# Altium project Nestling_2.0.PrjPCB
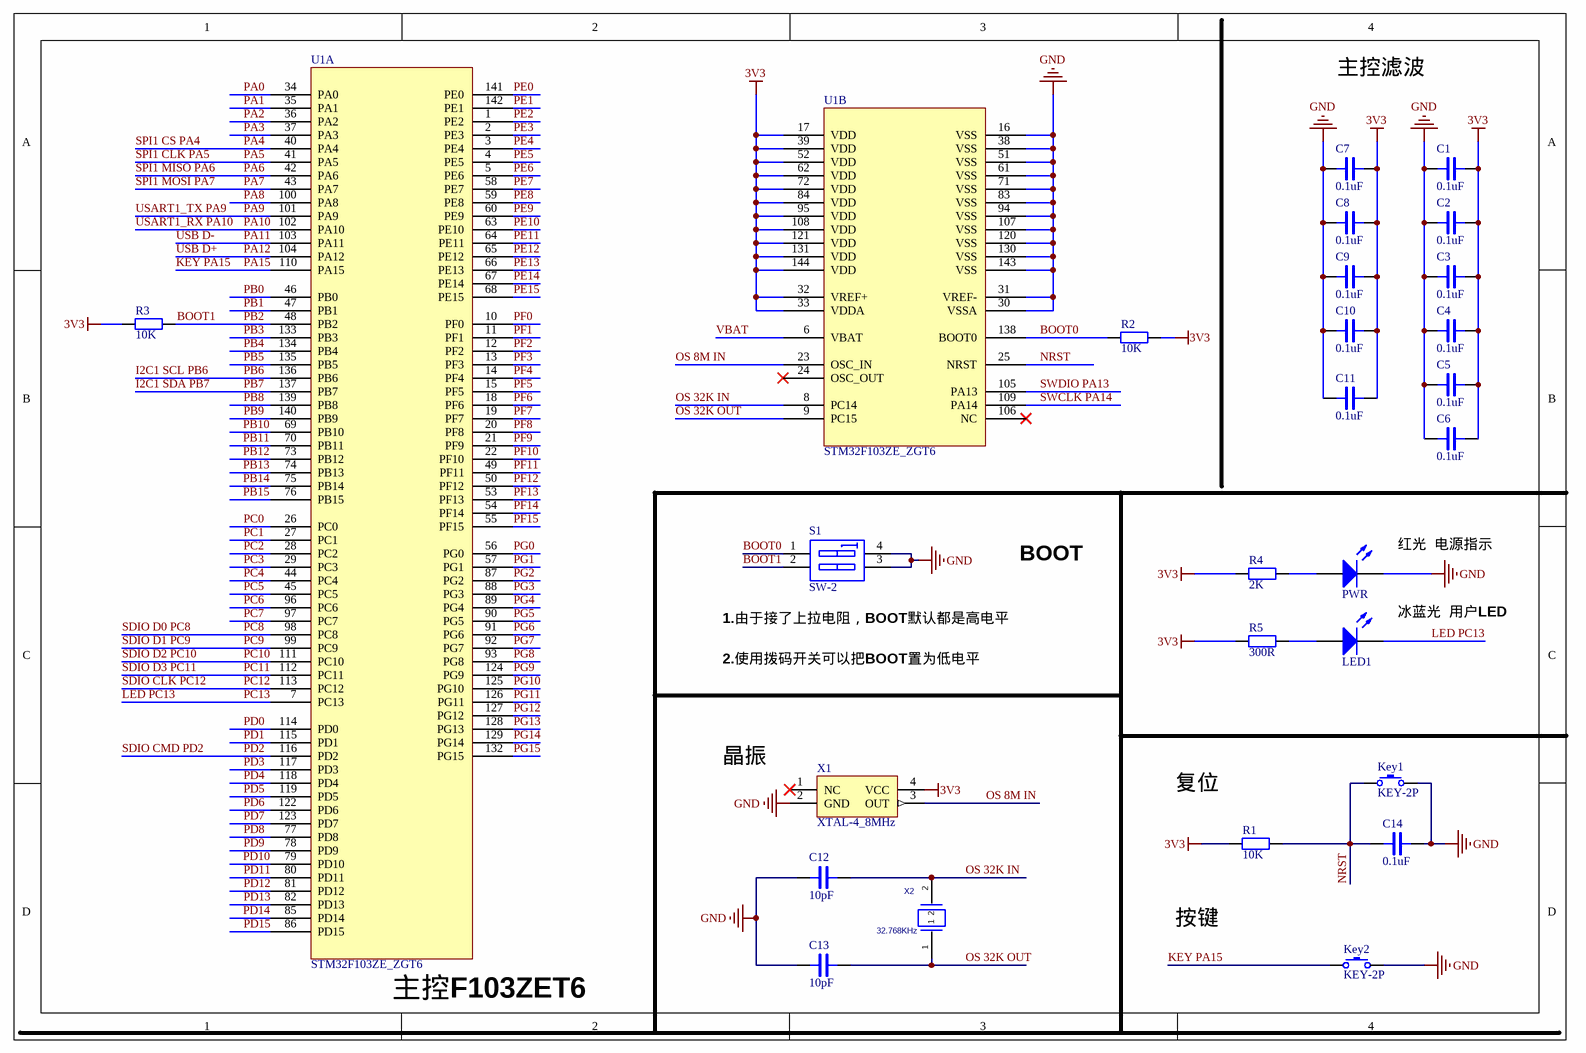
[diagram p0: 主控系统板.SchDoc]
2 sheets, 54 parts. Net scope: global (net labels, ports and power ports of the same name join across sheets).
Board file: Nestling_2.0.PcbDoc
Sheets:
  主控系统板.SchDoc
  主控系统板2.SchDoc

## Sheet 主控系统板.SchDoc
size A4

### Parts
C1  0.1uF  [0603]
C2  0.1uF  [0603]
C3  0.1uF  [0603]
C4  0.1uF  [0603]
C5  0.1uF  [0603]
C6  0.1uF  [0603]
C7  0.1uF  [0603]
C8  0.1uF  [0603]
C9  0.1uF  [0603]
C10  0.1uF  [0603]
C11  0.1uF  [0603]
C12  10pF  [0603]
C13  10pF  [0603]
C14  0.1uF  [0603]
Key1  KEY-2P  [TSW SMD-3*6*2.5]
Key2  KEY-2P  [TSW SMD-3*6*2.5]
LED1  LED  [D0603]  (value not drawn)
PWR  LED  [D0603]  (value not drawn)
R1  10K  [0603]
R2  10K  [0603]
R3  10K  [0603]
R4  2K  [0603]
R5  300R  [0603]
S1  SW-2  [CSW1.27 SMD-2P]
U1  STM32F103ZE_ZGT6  [TQFP144_N]  (parts A,B of 2)
X1  XTAL-4_8MHz  [XTAL-5.0X3.2]
X2  value 32.768KHz  [3215]  (hidden comment: XTAL_32.768KHZ_3215)

### Nets
3V3: C1.2 C2.2 C3.2 C4.2 C5.2 C6.2 C7.2 C8.2 C9.2 C10.2 C11.2 R1.1 R2.2 R3.2 R4.2 R5.2 U1.17(VDD) U1.32(VREF+) U1.33(VDDA) U1.39(VDD) U1.52(VDD) U1.62(VDD) U1.72(VDD) U1.84(VDD) U1.95(VDD) U1.108(VDD) U1.121(VDD) U1.131(VDD) U1.144(VDD) X1.4(VCC)
GND: C1.1 C2.1 C3.1 C4.1 C5.1 C6.1 C7.1 C8.1 C9.1 C10.1 C11.1 C12.2 C13.2 C14.1 Key1.2 Key2.2 PWR.2(K) S1.3(B2) S1.4(B1) U1.16(VSS) U1.30(VSSA) U1.31(VREF-) U1.38(VSS) U1.51(VSS) U1.61(VSS) U1.71(VSS) U1.83(VSS) U1.94(VSS) U1.107(VSS) U1.120(VSS) U1.130(VSS) U1.143(VSS) X1.2(GND)
BOOT0: R2.1 S1.1(A1) U1.138(BOOT0)
BOOT1: R3.1 S1.2(A2) U1.48(PB2)  [also labelled PB2]
I2C1 SCL PB6: U1.136(PB6)  [also labelled PB6]
I2C1 SDA PB7: U1.137(PB7)  [also labelled PB7]
KEY PA15: Key2.1 U1.110(PA15)  [also labelled PA15]
LED PC13: LED1.2(K) U1.7(PC13)  [also labelled PC13]
NRST: C14.2 Key1.1 R1.2 U1.25(NRST)
OS 8M IN: U1.23(OSC_IN) X1.3(OUT)
OS 32K IN: C12.1 U1.8(PC14) X2.2
OS 32K OUT: C13.1 U1.9(PC15) X2.1
PA0: U1.34(PA0)
PA1: U1.35(PA1)
PA2: U1.36(PA2)
PA3: U1.37(PA3)
PA4: U1.40(PA4)  [also labelled SPI1 CS PA4]
PA5: U1.41(PA5)  [also labelled SPI1 CLK PA5]
PA6: U1.42(PA6)  [also labelled SPI1 MISO PA6]
PA7: U1.43(PA7)  [also labelled SPI1 MOSI PA7]
PA8: U1.100(PA8)
PA9: U1.101(PA9)  [also labelled USART1_TX PA9]
PA10: U1.102(PA10)  [also labelled USART1_RX PA10]
PA11: U1.103(PA11)  [also labelled USB D-]
PA12: U1.104(PA12)  [also labelled USB D+]
PB0: U1.46(PB0)
PB1: U1.47(PB1)
PB3: U1.133(PB3)
PB4: U1.134(PB4)
PB5: U1.135(PB5)
PB8: U1.139(PB8)
PB9: U1.140(PB9)
PB10: U1.69(PB10)
PB11: U1.70(PB11)
PB12: U1.73(PB12)
PB13: U1.74(PB13)
PB14: U1.75(PB14)
PB15: U1.76(PB15)
PC0: U1.26(PC0)
PC1: U1.27(PC1)
PC2: U1.28(PC2)
PC3: U1.29(PC3)
PC4: U1.44(PC4)
PC5: U1.45(PC5)
PC6: U1.96(PC6)
PC7: U1.97(PC7)
PC8: U1.98(PC8)  [also labelled SDIO D0 PC8]
PC9: U1.99(PC9)  [also labelled SDIO D1 PC9]
PC10: U1.111(PC10)  [also labelled SDIO D2 PC10]
PC11: U1.112(PC11)  [also labelled SDIO D3 PC11]
PC12: U1.113(PC12)  [also labelled SDIO CLK PC12]
PD0: U1.114(PD0)
PD1: U1.115(PD1)
PD2: U1.116(PD2)  [also labelled SDIO CMD PD2]
PD3: U1.117(PD3)
PD4: U1.118(PD4)
PD5: U1.119(PD5)
PD6: U1.122(PD6)
PD7: U1.123(PD7)
PD8: U1.77(PD8)
PD9: U1.78(PD9)
PD10: U1.79(PD10)
PD11: U1.80(PD11)
PD12: U1.81(PD12)
PD13: U1.82(PD13)
PD14: U1.85(PD14)
PD15: U1.86(PD15)
PE0: U1.141(PE0)
PE1: U1.142(PE1)
PE2: U1.1(PE2)
PE3: U1.2(PE3)
PE4: U1.3(PE4)
PE5: U1.4(PE5)
PE6: U1.5(PE6)
PE7: U1.58(PE7)
PE8: U1.59(PE8)
PE9: U1.60(PE9)
PE10: U1.63(PE10)
PE11: U1.64(PE11)
PE12: U1.65(PE12)
PE13: U1.66(PE13)
PE14: U1.67(PE14)
PE15: U1.68(PE15)
PF0: U1.10(PF0)
PF1: U1.11(PF1)
PF2: U1.12(PF2)
PF3: U1.13(PF3)
PF4: U1.14(PF4)
PF5: U1.15(PF5)
PF6: U1.18(PF6)
PF7: U1.19(PF7)
PF8: U1.20(PF8)
PF9: U1.21(PF9)
PF10: U1.22(PF10)
PF11: U1.49(PF11)
PF12: U1.50(PF12)
PF13: U1.53(PF13)
PF14: U1.54(PF14)
PF15: U1.55(PF15)
PG0: U1.56(PG0)
PG1: U1.57(PG1)
PG2: U1.87(PG2)
PG3: U1.88(PG3)
PG4: U1.89(PG4)
PG5: U1.90(PG5)
PG6: U1.91(PG6)
PG7: U1.92(PG7)
PG8: U1.93(PG8)
PG9: U1.124(PG9)
PG10: U1.125(PG10)
PG11: U1.126(PG11)
PG12: U1.127(PG12)
PG13: U1.128(PG13)
PG14: U1.129(PG14)
PG15: U1.132(PG15)
SWCLK PA14: U1.109(PA14)
SWDIO PA13: U1.105(PA13)
VBAT: U1.6(VBAT)
NetLED1_1: LED1.1(A) R5.1
NetPWR_1: PWR.1(A) R4.1

Not connected (* = marked no-connect by the designer): U1 24(OSC_OUT)* 106(NC)*; X1 1(NC)*

### Notes on the sheet
- 主控滤波
- BOOT
- (near PWR) 红光  电源指示
- (near S1) 1.由于接了上拉电阻，BOOT默认都是高电平
- 2.使用拨码开关可以把BOOT置为低电平
- 冰蓝光  用户LED
- 晶振
- 复位
- 按键
- (near U1) 主控F103ZET6

### Library data of the parts
C1-C14 = CAP: Capacitor
Key1 Key2 = KEY-2P: Key
R1-R5 = RES: Resistor
X1 = XTAL-4: Oscillator
X2 = XTAL_32.768KHZ_3215: CRYSTAL; PCB DECAL: 3215

## Sheet 主控系统板2.SchDoc
size 381 x 199 mm
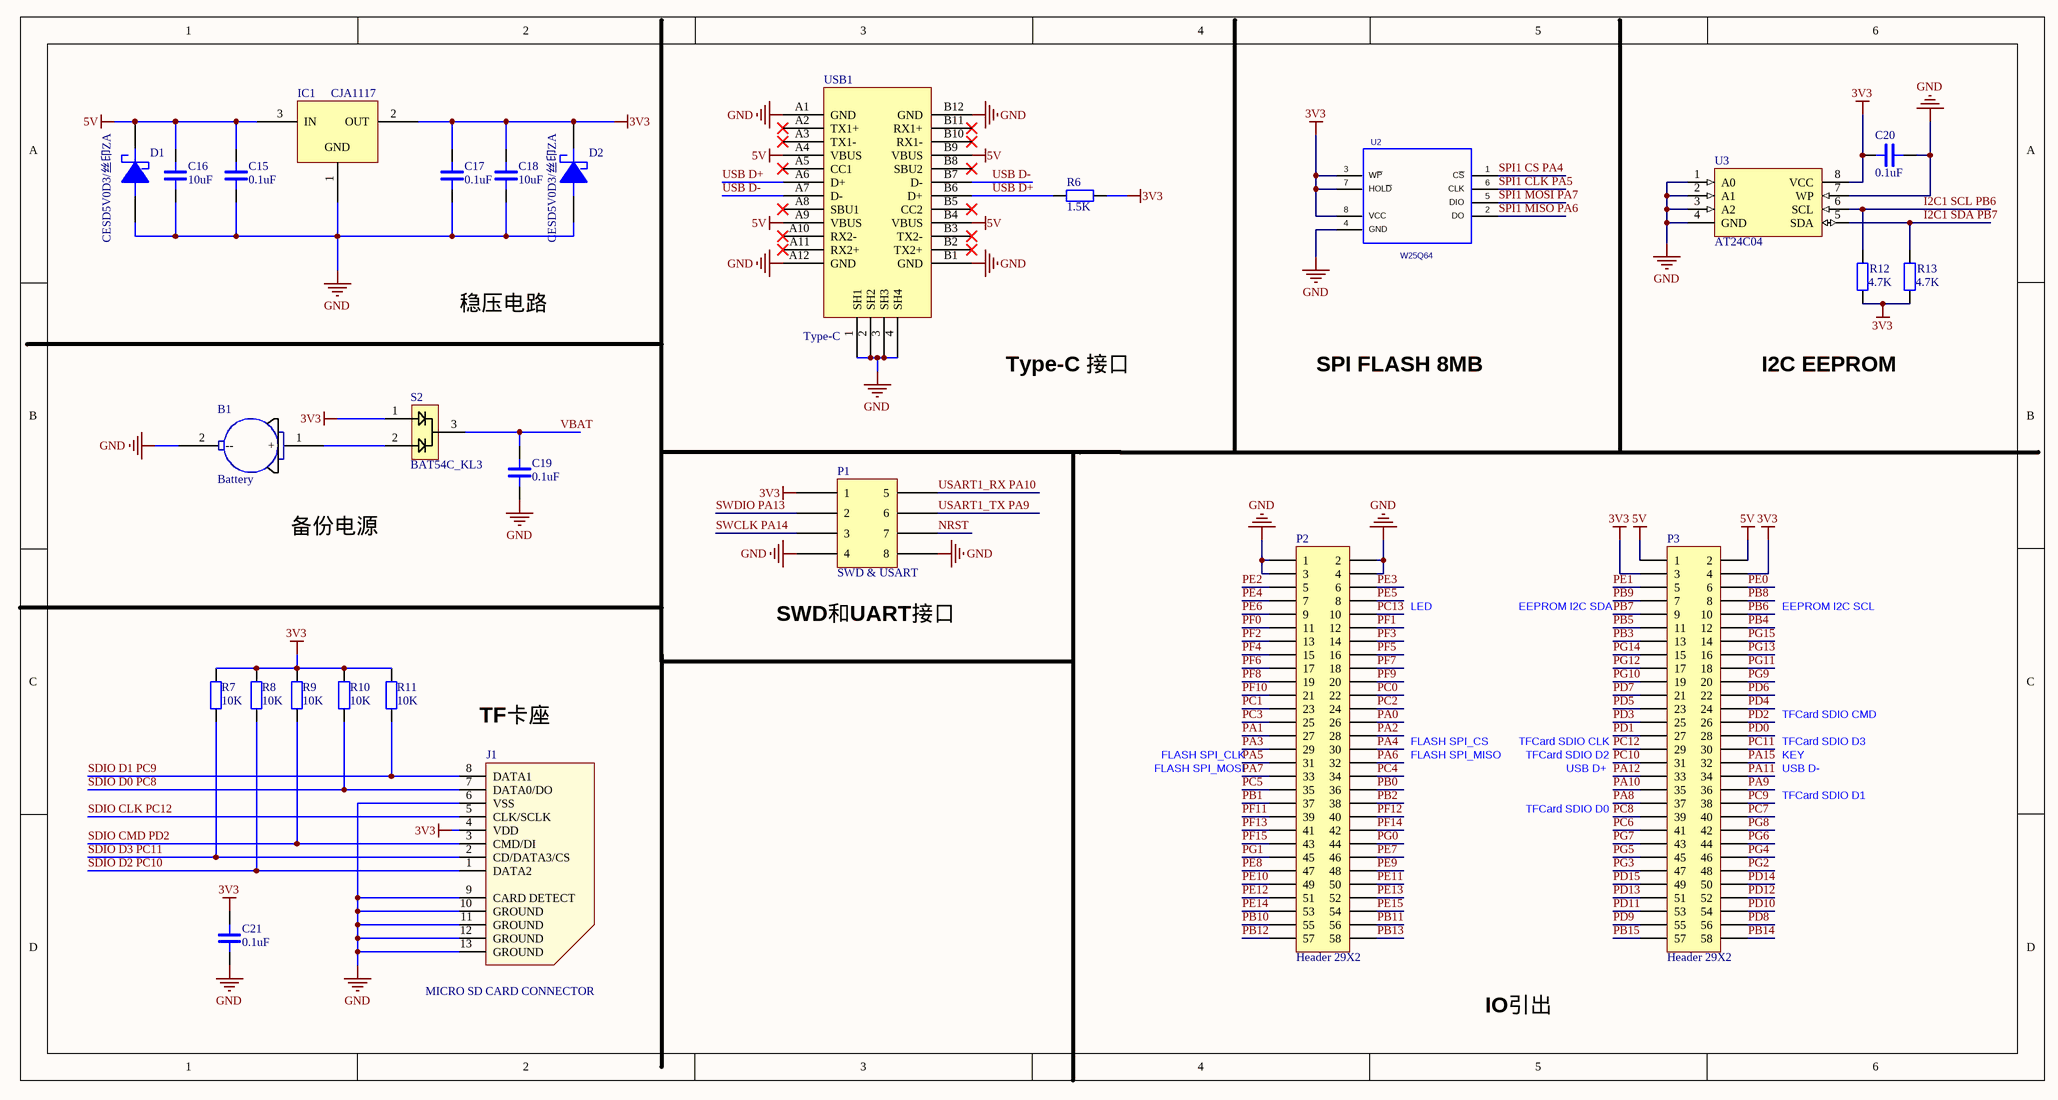
[diagram p1: 主控系统板2.SchDoc]

### Parts
B1  Battery  [CR1220]
C15  0.1uF  [0603]
C16  10uF  [0603]
C17  0.1uF  [0603]
C18  10uF  [0603]
C19  0.1uF  [0603]
C20  0.1uF  [0603]
C21  0.1uF  [0603]
D1  CESD5V0D3/丝印ZA  [SOD323]
D2  CESD5V0D3/丝印ZA  [SOD323]
IC1  CJA1117  [SOT89]
J1  MICRO SD CARD CONNECTOR  [MICRO SD CARD CONNECTOR]
P1  SWD & USART  [2X4P-2.5MM-SMD]
P2  Header 29X2  [HDR2X29]
P3  Header 29X2  [HDR2X29]
R6  1.5K  [0603]
R7  10K  [0603]
R8  10K  [0603]
R9  10K  [0603]
R10  10K  [0603]
R11  10K  [0603]
R12  4.7K  [0603]
R13  4.7K  [0603]
S2  BAT54C_KL3  [SOT-23]
U2  W25Q64  [SO8WB]
U3  AT24C04  [SO-8]
USB1  Type-C  [Type-C]

### Nets
3V3: C17.1 C18.1 C20.1 C21.1 D2.2(-) IC1.2(OUT) J1.4(VDD) P1.1 P3.3 P3.4 R6.1 R7.1 R8.1 R9.1 R10.1 R11.1 R12.2 R13.2 S2.1 U2.3(W~{P}) U2.7(HOL~{D}) U2.8(VCC) U3.8(VCC)
5V: C15.1 C16.1 D1.2(-) IC1.3(IN) P3.1 P3.2 USB1.A4(VBUS) USB1.A9(VBUS) USB1.B4(VBUS) USB1.B9(VBUS)
GND: B1.2(--) C15.2 C16.2 C17.2 C18.2 C19.2 C20.2 C21.2 D1.1(+) D2.1(+) IC1.1(GND) J1.6(VSS) J1.9(CARD_DETECT) J1.10(GROUND) J1.11(GROUND) J1.12(GROUND) J1.13(GROUND) P1.4 P1.8 P2.1 P2.2 P2.3 P2.4 U2.4(GND) U3.1(A0) U3.2(A1) U3.3(A2) U3.4(GND) U3.7(WP) USB1.1(SH1) USB1.2(SH2) USB1.3(SH3) USB1.4(SH4) USB1.A1(GND) USB1.A12(GND) USB1.B1(GND) USB1.B12(GND)
I2C1 SCL PB6: P3.10 R12.1 U3.6(SCL)  [also labelled PB6]
I2C1 SDA PB7: P3.9 R13.1 U3.5(SDA)  [also labelled PB7]
NRST: P1.7
PA0: P2.26
PA1: P2.27
PA2: P2.28
PA3: P2.29
PA4: P2.30 U2.1(C~{S})  [also labelled SPI1 CS PA4]
PA5: P2.31 U2.6(CLK)  [also labelled SPI1 CLK PA5]
PA6: P2.32 U2.2(DO)  [also labelled SPI1 MISO PA6]
PA7: P2.33 U2.5(DIO)  [also labelled SPI1 MOSI PA7]
PA8: P3.37
PA9: P1.6 P3.36  [also labelled USART1_TX PA9]
PA10: P1.5 P3.35  [also labelled USART1_RX PA10]
PA11: P3.34 USB1.A7(D-) USB1.B7(D-)  [also labelled USB D-]
PA12: P3.33 R6.2 USB1.A6(D+) USB1.B6(D+)  [also labelled USB D+]
PA15: P3.32  [project net KEY PA15]
PB0: P2.36
PB1: P2.37
PB2: P2.38  [project net BOOT1]
PB3: P3.13
PB4: P3.12
PB5: P3.11
PB8: P3.8
PB9: P3.7
PB10: P2.55
PB11: P2.56
PB12: P2.57
PB13: P2.58
PB14: P3.58
PB15: P3.57
PC0: P2.22
PC1: P2.23
PC2: P2.24
PC3: P2.25
PC4: P2.34
PC5: P2.35
PC6: P3.41
PC7: P3.40
PC8: J1.7(DATA0/DO) P3.39 R10.2  [also labelled SDIO D0 PC8]
PC9: J1.8(DATA1) P3.38 R11.2  [also labelled SDIO D1 PC9]
PC10: J1.1(DATA2) P3.31 R8.2  [also labelled SDIO D2 PC10]
PC11: J1.2(CD/DATA3/CS) P3.30 R7.2  [also labelled SDIO D3 PC11]
PC12: J1.5(CLK/SCLK) P3.29  [also labelled SDIO CLK PC12]
PC13: P2.10  [project net LED PC13]
PD0: P3.28
PD1: P3.27
PD2: J1.3(CMD/DI) P3.26 R9.2  [also labelled SDIO CMD PD2]
PD3: P3.25
PD4: P3.24
PD5: P3.23
PD6: P3.22
PD7: P3.21
PD8: P3.56
PD9: P3.55
PD10: P3.54
PD11: P3.53
PD12: P3.52
PD13: P3.51
PD14: P3.50
PD15: P3.49
PE0: P3.6
PE1: P3.5
PE2: P2.5
PE3: P2.6
PE4: P2.7
PE5: P2.8
PE6: P2.9
PE7: P2.46
PE8: P2.47
PE9: P2.48
PE10: P2.49
PE11: P2.50
PE12: P2.51
PE13: P2.52
PE14: P2.53
PE15: P2.54
PF0: P2.11
PF1: P2.12
PF2: P2.13
PF3: P2.14
PF4: P2.15
PF5: P2.16
PF6: P2.17
PF7: P2.18
PF8: P2.19
PF9: P2.20
PF10: P2.21
PF11: P2.39
PF12: P2.40
PF13: P2.41
PF14: P2.42
PF15: P2.43
PG0: P2.44
PG1: P2.45
PG2: P3.48
PG3: P3.47
PG4: P3.46
PG5: P3.45
PG6: P3.44
PG7: P3.43
PG8: P3.42
PG9: P3.20
PG10: P3.19
PG11: P3.18
PG12: P3.17
PG13: P3.16
PG14: P3.15
PG15: P3.14
SWCLK PA14: P1.3
SWDIO PA13: P1.2
VBAT: C19.1 S2.3
NetB1_1: B1.1(+) S2.2

Not connected (* = marked no-connect by the designer): USB1 A2(TX1+)* A3(TX1-)* A5(CC1)* A8(SBU1)* A10(RX2-)* A11(RX2+)* B2(TX2+)* B3(TX2-)* B5(CC2)* B8(SBU2)* B10(RX1-)* B11(RX1+)*

### Notes on the sheet
- 稳压电路
- Type-C 接口
- SPI FLASH 8MB
- I2C EEPROM
- 备份电源
- (near P1) SWD和UART接口
- LED
- EEPROM I2C SDA
- EEPROM I2C SCL
- (near J1) TF卡座
- FLASH SPI_CLK
- FLASH SPI_CS
- FLASH SPI_MISO
- TFCard SDIO CLK
- TFCard SDIO D2
- KEY
- TFCard SDIO D3
- TFCard SDIO CMD
- FLASH SPI_MOSI
- TFCard SDIO D0
- USB D+
- USB D-
- TFCard SDIO D1
- IO引出

### Library data of the parts
C15-C21 = CAP: Capacitor
D1 D2 = TVS
P1 = CON4-X2
R6-R13 = RES: Resistor
U3 = AT24Cxx: EEPROM
U2 = W25Q64: PCB DECAL: SO8WB

## Nets that join several sheets
3V3: 主控系统板 (30 pins), 主控系统板2 (23 pins)
GND: 主控系统板 (33 pins), 主控系统板2 (37 pins)
BOOT1: 主控系统板 (R3.1 S1.2 U1.48), 主控系统板2 (P2.38)
I2C1 SCL PB6: 主控系统板 (U1.136), 主控系统板2 (P3.10 R12.1 U3.6)
I2C1 SDA PB7: 主控系统板 (U1.137), 主控系统板2 (P3.9 R13.1 U3.5)
KEY PA15: 主控系统板 (Key2.1 U1.110), 主控系统板2 (P3.32)
LED PC13: 主控系统板 (LED1.2 U1.7), 主控系统板2 (P2.10)
NRST: 主控系统板 (C14.2 Key1.1 R1.2 U1.25), 主控系统板2 (P1.7)
PA0: 主控系统板 (U1.34), 主控系统板2 (P2.26)
PA1: 主控系统板 (U1.35), 主控系统板2 (P2.27)
PA2: 主控系统板 (U1.36), 主控系统板2 (P2.28)
PA3: 主控系统板 (U1.37), 主控系统板2 (P2.29)
PA4: 主控系统板 (U1.40), 主控系统板2 (P2.30 U2.1)
PA5: 主控系统板 (U1.41), 主控系统板2 (P2.31 U2.6)
PA6: 主控系统板 (U1.42), 主控系统板2 (P2.32 U2.2)
PA7: 主控系统板 (U1.43), 主控系统板2 (P2.33 U2.5)
PA8: 主控系统板 (U1.100), 主控系统板2 (P3.37)
PA9: 主控系统板 (U1.101), 主控系统板2 (P1.6 P3.36)
PA10: 主控系统板 (U1.102), 主控系统板2 (P1.5 P3.35)
PA11: 主控系统板 (U1.103), 主控系统板2 (P3.34 USB1.A7 USB1.B7)
PA12: 主控系统板 (U1.104), 主控系统板2 (P3.33 R6.2 USB1.A6 USB1.B6)
PB0: 主控系统板 (U1.46), 主控系统板2 (P2.36)
PB1: 主控系统板 (U1.47), 主控系统板2 (P2.37)
PB3: 主控系统板 (U1.133), 主控系统板2 (P3.13)
PB4: 主控系统板 (U1.134), 主控系统板2 (P3.12)
PB5: 主控系统板 (U1.135), 主控系统板2 (P3.11)
PB8: 主控系统板 (U1.139), 主控系统板2 (P3.8)
PB9: 主控系统板 (U1.140), 主控系统板2 (P3.7)
PB10: 主控系统板 (U1.69), 主控系统板2 (P2.55)
PB11: 主控系统板 (U1.70), 主控系统板2 (P2.56)
PB12: 主控系统板 (U1.73), 主控系统板2 (P2.57)
PB13: 主控系统板 (U1.74), 主控系统板2 (P2.58)
PB14: 主控系统板 (U1.75), 主控系统板2 (P3.58)
PB15: 主控系统板 (U1.76), 主控系统板2 (P3.57)
PC0: 主控系统板 (U1.26), 主控系统板2 (P2.22)
PC1: 主控系统板 (U1.27), 主控系统板2 (P2.23)
PC2: 主控系统板 (U1.28), 主控系统板2 (P2.24)
PC3: 主控系统板 (U1.29), 主控系统板2 (P2.25)
PC4: 主控系统板 (U1.44), 主控系统板2 (P2.34)
PC5: 主控系统板 (U1.45), 主控系统板2 (P2.35)
PC6: 主控系统板 (U1.96), 主控系统板2 (P3.41)
PC7: 主控系统板 (U1.97), 主控系统板2 (P3.40)
PC8: 主控系统板 (U1.98), 主控系统板2 (J1.7 P3.39 R10.2)
PC9: 主控系统板 (U1.99), 主控系统板2 (J1.8 P3.38 R11.2)
PC10: 主控系统板 (U1.111), 主控系统板2 (J1.1 P3.31 R8.2)
PC11: 主控系统板 (U1.112), 主控系统板2 (J1.2 P3.30 R7.2)
PC12: 主控系统板 (U1.113), 主控系统板2 (J1.5 P3.29)
PD0: 主控系统板 (U1.114), 主控系统板2 (P3.28)
PD1: 主控系统板 (U1.115), 主控系统板2 (P3.27)
PD2: 主控系统板 (U1.116), 主控系统板2 (J1.3 P3.26 R9.2)
PD3: 主控系统板 (U1.117), 主控系统板2 (P3.25)
PD4: 主控系统板 (U1.118), 主控系统板2 (P3.24)
PD5: 主控系统板 (U1.119), 主控系统板2 (P3.23)
PD6: 主控系统板 (U1.122), 主控系统板2 (P3.22)
PD7: 主控系统板 (U1.123), 主控系统板2 (P3.21)
PD8: 主控系统板 (U1.77), 主控系统板2 (P3.56)
PD9: 主控系统板 (U1.78), 主控系统板2 (P3.55)
PD10: 主控系统板 (U1.79), 主控系统板2 (P3.54)
PD11: 主控系统板 (U1.80), 主控系统板2 (P3.53)
PD12: 主控系统板 (U1.81), 主控系统板2 (P3.52)
PD13: 主控系统板 (U1.82), 主控系统板2 (P3.51)
PD14: 主控系统板 (U1.85), 主控系统板2 (P3.50)
PD15: 主控系统板 (U1.86), 主控系统板2 (P3.49)
PE0: 主控系统板 (U1.141), 主控系统板2 (P3.6)
PE1: 主控系统板 (U1.142), 主控系统板2 (P3.5)
PE2: 主控系统板 (U1.1), 主控系统板2 (P2.5)
PE3: 主控系统板 (U1.2), 主控系统板2 (P2.6)
PE4: 主控系统板 (U1.3), 主控系统板2 (P2.7)
PE5: 主控系统板 (U1.4), 主控系统板2 (P2.8)
PE6: 主控系统板 (U1.5), 主控系统板2 (P2.9)
PE7: 主控系统板 (U1.58), 主控系统板2 (P2.46)
PE8: 主控系统板 (U1.59), 主控系统板2 (P2.47)
PE9: 主控系统板 (U1.60), 主控系统板2 (P2.48)
PE10: 主控系统板 (U1.63), 主控系统板2 (P2.49)
PE11: 主控系统板 (U1.64), 主控系统板2 (P2.50)
PE12: 主控系统板 (U1.65), 主控系统板2 (P2.51)
PE13: 主控系统板 (U1.66), 主控系统板2 (P2.52)
PE14: 主控系统板 (U1.67), 主控系统板2 (P2.53)
PE15: 主控系统板 (U1.68), 主控系统板2 (P2.54)
PF0: 主控系统板 (U1.10), 主控系统板2 (P2.11)
PF1: 主控系统板 (U1.11), 主控系统板2 (P2.12)
PF2: 主控系统板 (U1.12), 主控系统板2 (P2.13)
PF3: 主控系统板 (U1.13), 主控系统板2 (P2.14)
PF4: 主控系统板 (U1.14), 主控系统板2 (P2.15)
PF5: 主控系统板 (U1.15), 主控系统板2 (P2.16)
PF6: 主控系统板 (U1.18), 主控系统板2 (P2.17)
PF7: 主控系统板 (U1.19), 主控系统板2 (P2.18)
PF8: 主控系统板 (U1.20), 主控系统板2 (P2.19)
PF9: 主控系统板 (U1.21), 主控系统板2 (P2.20)
PF10: 主控系统板 (U1.22), 主控系统板2 (P2.21)
PF11: 主控系统板 (U1.49), 主控系统板2 (P2.39)
PF12: 主控系统板 (U1.50), 主控系统板2 (P2.40)
PF13: 主控系统板 (U1.53), 主控系统板2 (P2.41)
PF14: 主控系统板 (U1.54), 主控系统板2 (P2.42)
PF15: 主控系统板 (U1.55), 主控系统板2 (P2.43)
PG0: 主控系统板 (U1.56), 主控系统板2 (P2.44)
PG1: 主控系统板 (U1.57), 主控系统板2 (P2.45)
PG2: 主控系统板 (U1.87), 主控系统板2 (P3.48)
PG3: 主控系统板 (U1.88), 主控系统板2 (P3.47)
PG4: 主控系统板 (U1.89), 主控系统板2 (P3.46)
PG5: 主控系统板 (U1.90), 主控系统板2 (P3.45)
PG6: 主控系统板 (U1.91), 主控系统板2 (P3.44)
PG7: 主控系统板 (U1.92), 主控系统板2 (P3.43)
PG8: 主控系统板 (U1.93), 主控系统板2 (P3.42)
PG9: 主控系统板 (U1.124), 主控系统板2 (P3.20)
PG10: 主控系统板 (U1.125), 主控系统板2 (P3.19)
PG11: 主控系统板 (U1.126), 主控系统板2 (P3.18)
PG12: 主控系统板 (U1.127), 主控系统板2 (P3.17)
PG13: 主控系统板 (U1.128), 主控系统板2 (P3.16)
PG14: 主控系统板 (U1.129), 主控系统板2 (P3.15)
PG15: 主控系统板 (U1.132), 主控系统板2 (P3.14)
SWCLK PA14: 主控系统板 (U1.109), 主控系统板2 (P1.3)
SWDIO PA13: 主控系统板 (U1.105), 主控系统板2 (P1.2)
VBAT: 主控系统板 (U1.6), 主控系统板2 (C19.1 S2.3)